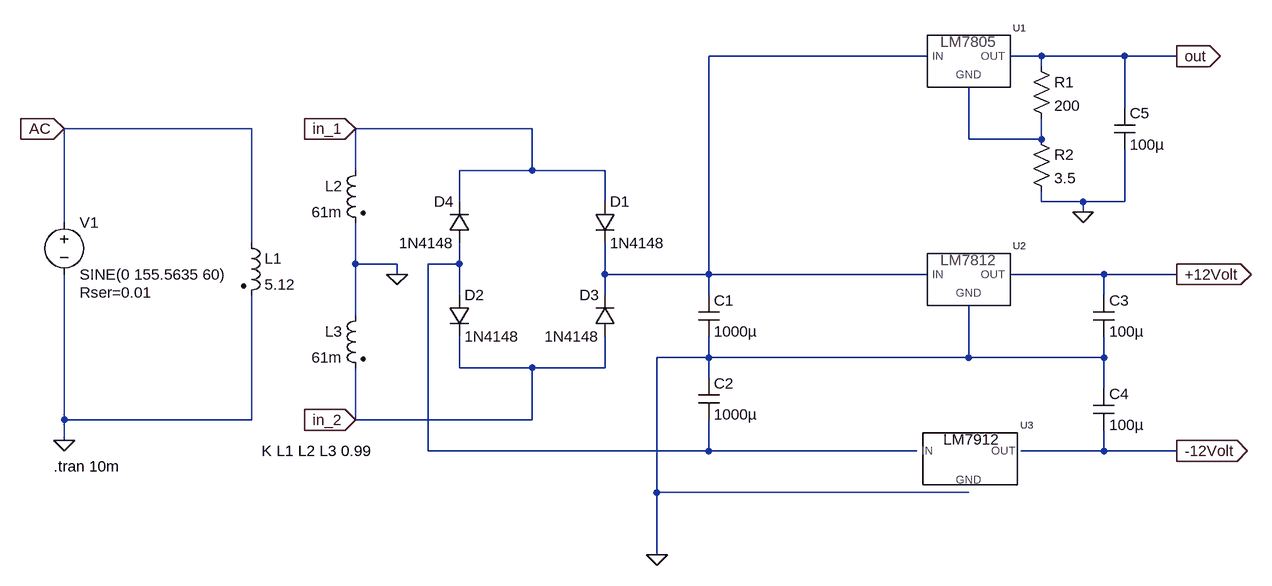
[diagram p0: schematic Zener_Shunt_Regular.asc]
Zener_Shunt_Regular.asc, the LTspice schematic file:
Version 4
SHEET 1 2160 680
WIRE 368 -288 32 -288
WIRE 544 -288 496 -288
WIRE 672 -288 544 -288
WIRE 752 -288 672 -288
WIRE 544 -272 544 -288
WIRE 672 -208 672 -288
WIRE -672 -176 -960 -176
WIRE -240 -176 -512 -176
WIRE 432 -160 432 -240
WIRE 544 -160 544 -192
WIRE 544 -160 432 -160
WIRE -512 -112 -512 -176
WIRE -240 -112 -240 -176
WIRE -240 -112 -352 -112
WIRE -128 -112 -240 -112
WIRE -352 -64 -352 -112
WIRE -128 -64 -128 -112
WIRE 544 -64 544 -80
WIRE 608 -64 544 -64
WIRE 672 -64 672 -144
WIRE 672 -64 608 -64
WIRE 608 -48 608 -64
WIRE -960 -32 -960 -176
WIRE -672 0 -672 -176
WIRE -512 32 -512 -32
WIRE -448 32 -512 32
WIRE -352 32 -352 0
WIRE -352 32 -400 32
WIRE -448 48 -448 32
WIRE -128 48 -128 0
WIRE 32 48 32 -288
WIRE 32 48 -128 48
WIRE 368 48 32 48
WIRE 640 48 496 48
WIRE 752 48 640 48
WIRE -352 80 -352 32
WIRE -128 80 -128 48
WIRE 32 80 32 48
WIRE 640 80 640 48
WIRE -512 112 -512 32
WIRE 32 176 32 144
WIRE 32 176 -48 176
WIRE 432 176 432 96
WIRE 432 176 32 176
WIRE 640 176 640 144
WIRE 640 176 432 176
WIRE -352 192 -352 144
WIRE -240 192 -352 192
WIRE -128 192 -128 144
WIRE -128 192 -240 192
WIRE 32 208 32 176
WIRE 640 224 640 176
WIRE -960 272 -960 48
WIRE -672 272 -672 80
WIRE -672 272 -960 272
WIRE -512 272 -512 192
WIRE -240 272 -240 192
WIRE -240 272 -512 272
WIRE -960 304 -960 272
WIRE -400 320 -400 32
WIRE 32 320 32 272
WIRE 32 320 -400 320
WIRE 352 320 32 320
WIRE 640 320 640 288
WIRE 640 320 512 320
WIRE 752 320 640 320
WIRE -48 384 -48 176
WIRE 432 384 -48 384
WIRE -48 480 -48 384
FLAG -960 304 0
FLAG -448 48 0
FLAG -512 -176 in_1
IOPIN -512 -176 In
FLAG -512 272 in_2
IOPIN -512 272 In
FLAG -960 -176 AC
IOPIN -960 -176 In
FLAG -48 480 0
FLAG 752 320 -12Volt
IOPIN 752 320 Out
FLAG 752 48 +12Volt
IOPIN 752 48 Out
FLAG 608 -48 0
FLAG 752 -288 out
IOPIN 752 -288 Out
SYMBOL voltage -960 -48 R0
WINDOW 123 0 0 Left 0
WINDOW 39 24 124 Left 2
SYMATTR SpiceLine Rser=0.01
SYMATTR InstName V1
SYMATTR Value SINE(0 155.5635 60)
SYMBOL ind2 -688 -16 R0
SYMATTR InstName L1
SYMATTR Value 5.12
SYMATTR Type ind
SYMBOL ind2 -496 -128 M0
SYMATTR InstName L2
SYMATTR Value 61m
SYMATTR Type ind
SYMBOL ind2 -496 96 M0
SYMATTR InstName L3
SYMATTR Value 61m
SYMATTR Type ind
SYMBOL diode -144 -64 R0
SYMATTR InstName D1
SYMATTR Value 1N4148
SYMBOL diode -368 80 R0
SYMATTR InstName D2
SYMATTR Value 1N4148
SYMBOL diode -112 144 R180
WINDOW 0 24 64 Left 2
WINDOW 3 24 0 Left 2
SYMATTR InstName D3
SYMATTR Value 1N4148
SYMBOL diode -336 0 R180
WINDOW 0 24 64 Left 2
WINDOW 3 24 0 Left 2
SYMATTR InstName D4
SYMATTR Value 1N4148
SYMBOL cap 16 80 R0
SYMATTR InstName C1
SYMATTR Value 1000µ
SYMBOL cap 16 208 R0
SYMATTR InstName C2
SYMATTR Value 1000µ
SYMBOL LM7805 432 -288 R0
SYMATTR InstName U1
SYMBOL LM7812 432 48 R0
SYMATTR InstName U2
SYMBOL LM7912 432 320 R0
SYMATTR InstName U3
SYMBOL cap 624 80 R0
SYMATTR InstName C3
SYMATTR Value 100µ
SYMBOL cap 624 224 R0
SYMATTR InstName C4
SYMATTR Value 100µ
SYMBOL cap 656 -208 R0
SYMATTR InstName C5
SYMATTR Value 100µ
SYMBOL res 528 -288 R0
SYMATTR InstName R1
SYMATTR Value 200
SYMBOL res 528 -176 R0
SYMATTR InstName R2
SYMATTR Value 3.5
TEXT -656 320 Left 2 !K L1 L2 L3 0.99
TEXT -976 344 Left 2 !.tran 10m

The netlist it stands for:
* Zener_Shunt_Regular.asc
V1 AC 0 SINE(0 155.5635 60) Rser=0.01
L1 AC 0 5.12
L2 in_1 0 61m
L3 0 in_2 61m
D1 in_1 N001 1N4148
D2 N003 in_2 1N4148
D3 in_2 N001 1N4148
D4 N003 in_1 1N4148
C1 N001 0 1000µ
C2 0 N003 1000µ
XU1 N001 N002 out LM7805 LM7805  ; pins IN GND OUT
XU2 N001 0 +12Volt LM7812 LM7812  ; pins IN GND OUT
XU3 N003 0 -12Volt LM7912 LM7912  ; pins IN GND OUT
C3 +12Volt 0 100µ
C4 0 -12Volt 100µ
C5 out 0 100µ
R1 out N002 200
R2 N002 0 3.5
.model D D
.lib standard.dio
K L1 L2 L3 0.99
.tran 10m
.lib LM7805_7812_7815.lib
.lib C:\Users\eeta\Documents\LTspiceXVII\lib\sub\lm7905_7912_7915.lib
.backanno
.end